# EAGLE design 4-layer-microstrip-nomask-osh (EAGLE 9.4.1)
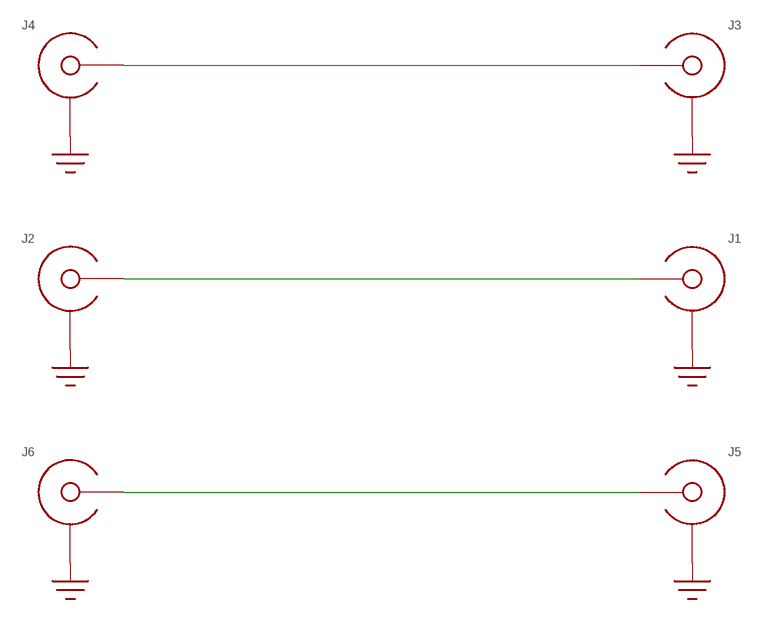
[diagram p0: schematic, sheet 1]

## Parts
J1  SMA-EDGE-LAUNCH4L-4020-TAPER-FIXED  [SMA_EDGE_LAUNCH_4L_4020_TAPER_FIXED]
J2  SMA-EDGE-LAUNCH4L-4020-TAPER-FIXED  [SMA_EDGE_LAUNCH_4L_4020_TAPER_FIXED]
J3  SMA-EDGE-LAUNCH4L-4020-TAPER-FIXED  [SMA_EDGE_LAUNCH_4L_4020_TAPER_FIXED]
J4  SMA-EDGE-LAUNCH4L-4020-TAPER-FIXED  [SMA_EDGE_LAUNCH_4L_4020_TAPER_FIXED]
J5  SMA-EDGE-LAUNCH4L-4020-TAPER-FIXED  [SMA_EDGE_LAUNCH_4L_4020_TAPER_FIXED]
J6  SMA-EDGE-LAUNCH4L-4020-TAPER-FIXED  [SMA_EDGE_LAUNCH_4L_4020_TAPER_FIXED]

## Nets
GND: J1.BOTTOM_GND(SHIELD) J1.GND@1(SHIELD) J1.GND@2(SHIELD) J1.GND@3(SHIELD) J1.GND@4(SHIELD) J1.GND@5(SHIELD) J1.GND@6(SHIELD) J1.GND@7(SHIELD) J1.GND@8(SHIELD) J1.GND@14(SHIELD) J1.GND@15(SHIELD) J1.GND@16(SHIELD) J1.GND@17(SHIELD) J1.GND_PAD1(SHIELD) J1.GND_PAD2(SHIELD) J1.P$1(SHIELD) J1.P$2(SHIELD) J2.BOTTOM_GND(SHIELD) J2.GND@1(SHIELD) J2.GND@2(SHIELD) J2.GND@3(SHIELD) J2.GND@4(SHIELD) J2.GND@5(SHIELD) J2.GND@6(SHIELD) J2.GND@7(SHIELD) J2.GND@8(SHIELD) J2.GND@14(SHIELD) J2.GND@15(SHIELD) J2.GND@16(SHIELD) J2.GND@17(SHIELD) J2.GND_PAD1(SHIELD) J2.GND_PAD2(SHIELD) J2.P$1(SHIELD) J2.P$2(SHIELD) J3.BOTTOM_GND(SHIELD) J3.GND@1(SHIELD) J3.GND@2(SHIELD) J3.GND@3(SHIELD) J3.GND@4(SHIELD) J3.GND@5(SHIELD) J3.GND@6(SHIELD) J3.GND@7(SHIELD) J3.GND@8(SHIELD) J3.GND@14(SHIELD) J3.GND@15(SHIELD) J3.GND@16(SHIELD) J3.GND@17(SHIELD) J3.GND_PAD1(SHIELD) J3.GND_PAD2(SHIELD) J3.P$1(SHIELD) J3.P$2(SHIELD) J4.BOTTOM_GND(SHIELD) J4.GND@1(SHIELD) J4.GND@2(SHIELD) J4.GND@3(SHIELD) J4.GND@4(SHIELD) J4.GND@5(SHIELD) J4.GND@6(SHIELD) J4.GND@7(SHIELD) J4.GND@8(SHIELD) J4.GND@14(SHIELD) J4.GND@15(SHIELD) J4.GND@16(SHIELD) J4.GND@17(SHIELD) J4.GND_PAD1(SHIELD) J4.GND_PAD2(SHIELD) J4.P$1(SHIELD) J4.P$2(SHIELD) J5.BOTTOM_GND(SHIELD) J5.GND@1(SHIELD) J5.GND@2(SHIELD) J5.GND@3(SHIELD) J5.GND@4(SHIELD) J5.GND@5(SHIELD) J5.GND@6(SHIELD) J5.GND@7(SHIELD) J5.GND@8(SHIELD) J5.GND@14(SHIELD) J5.GND@15(SHIELD) J5.GND@16(SHIELD) J5.GND@17(SHIELD) J5.GND_PAD1(SHIELD) J5.GND_PAD2(SHIELD) J5.P$1(SHIELD) J5.P$2(SHIELD) J6.BOTTOM_GND(SHIELD) J6.GND@1(SHIELD) J6.GND@2(SHIELD) J6.GND@3(SHIELD) J6.GND@4(SHIELD) J6.GND@5(SHIELD) J6.GND@6(SHIELD) J6.GND@7(SHIELD) J6.GND@8(SHIELD) J6.GND@14(SHIELD) J6.GND@15(SHIELD) J6.GND@16(SHIELD) J6.GND@17(SHIELD) J6.GND_PAD1(SHIELD) J6.GND_PAD2(SHIELD) J6.P$1(SHIELD) J6.P$2(SHIELD)
N$1 [50-ohm]: J1.CENTER@1(CENTER) J1.P$3(CENTER) J2.CENTER@1(CENTER) J2.P$3(CENTER)
N$2 [50-ohm]: J3.CENTER@1(CENTER) J3.P$3(CENTER) J4.CENTER@1(CENTER) J4.P$3(CENTER)
N$3 [50-ohm]: J5.CENTER@1(CENTER) J5.P$3(CENTER) J6.CENTER@1(CENTER) J6.P$3(CENTER)

## Library data of the parts
J1-J6 = yapo:SMA-EDGE-LAUNCH

## Net classes
1 50-ohm: clearance 2.54 mm

## Board
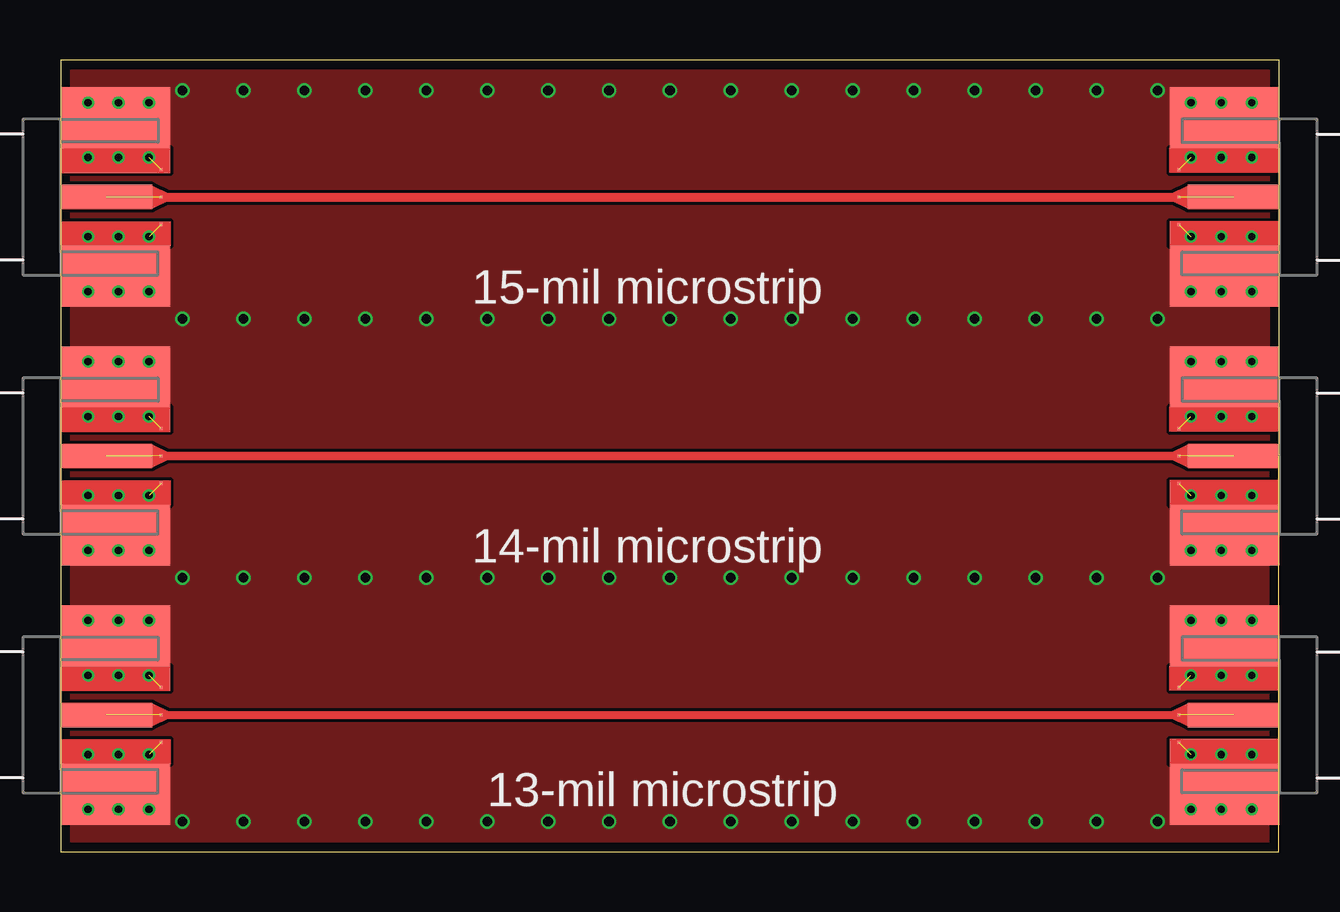
[diagram p1: board, top side]
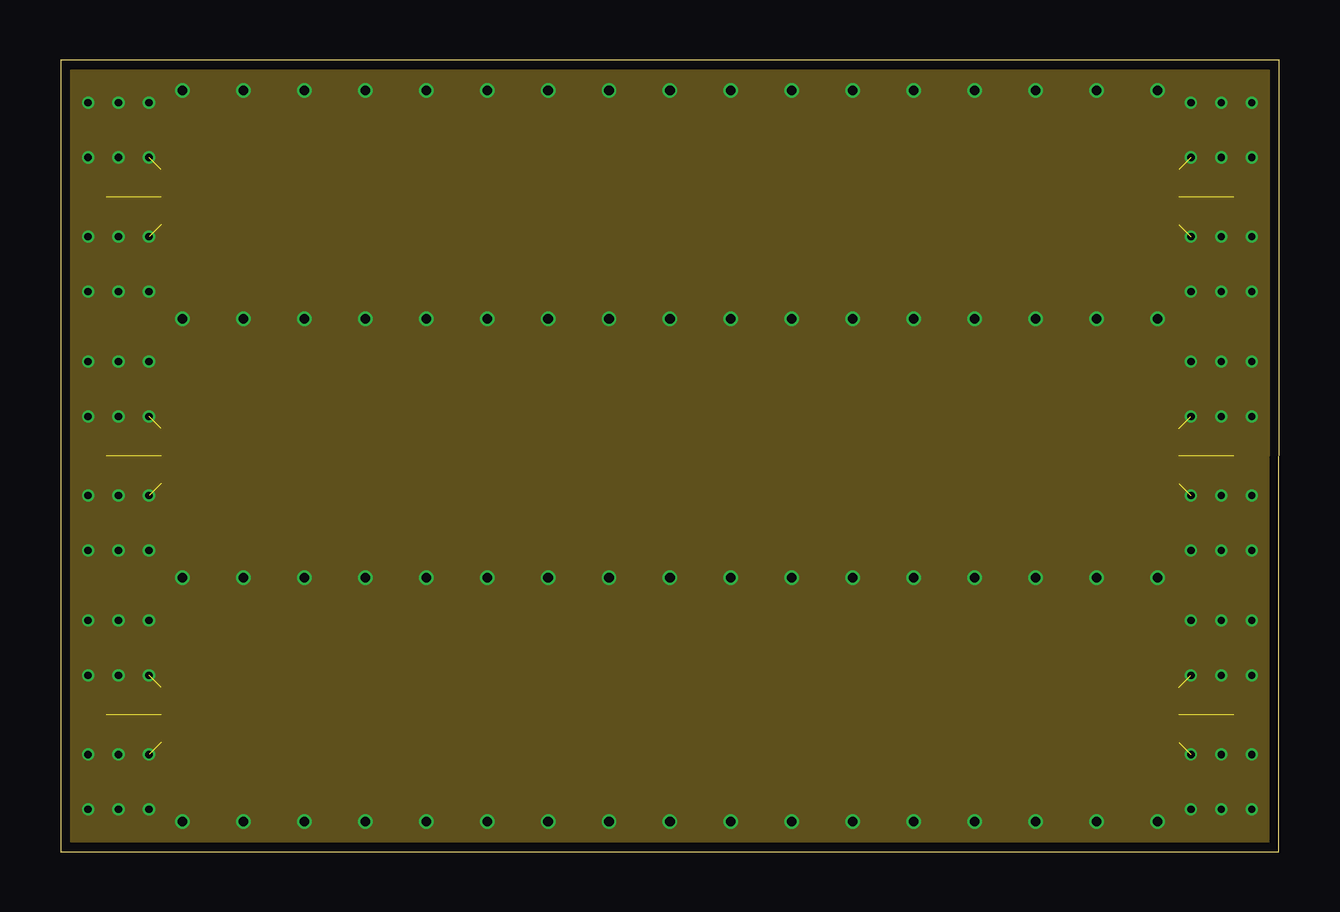
[diagram p2: board, inner layer Route2]
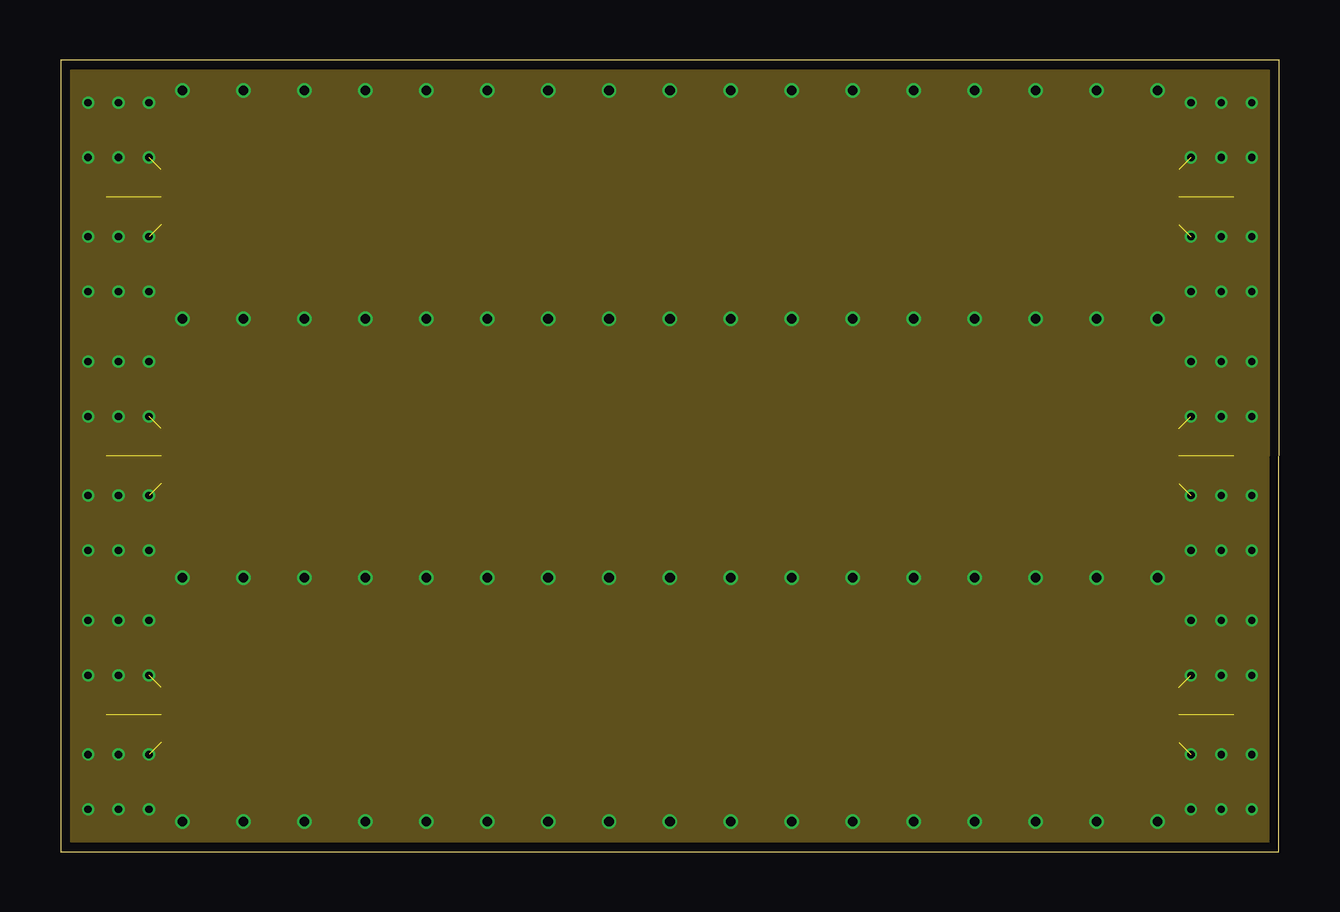
[diagram p3: board, inner layer Route15]
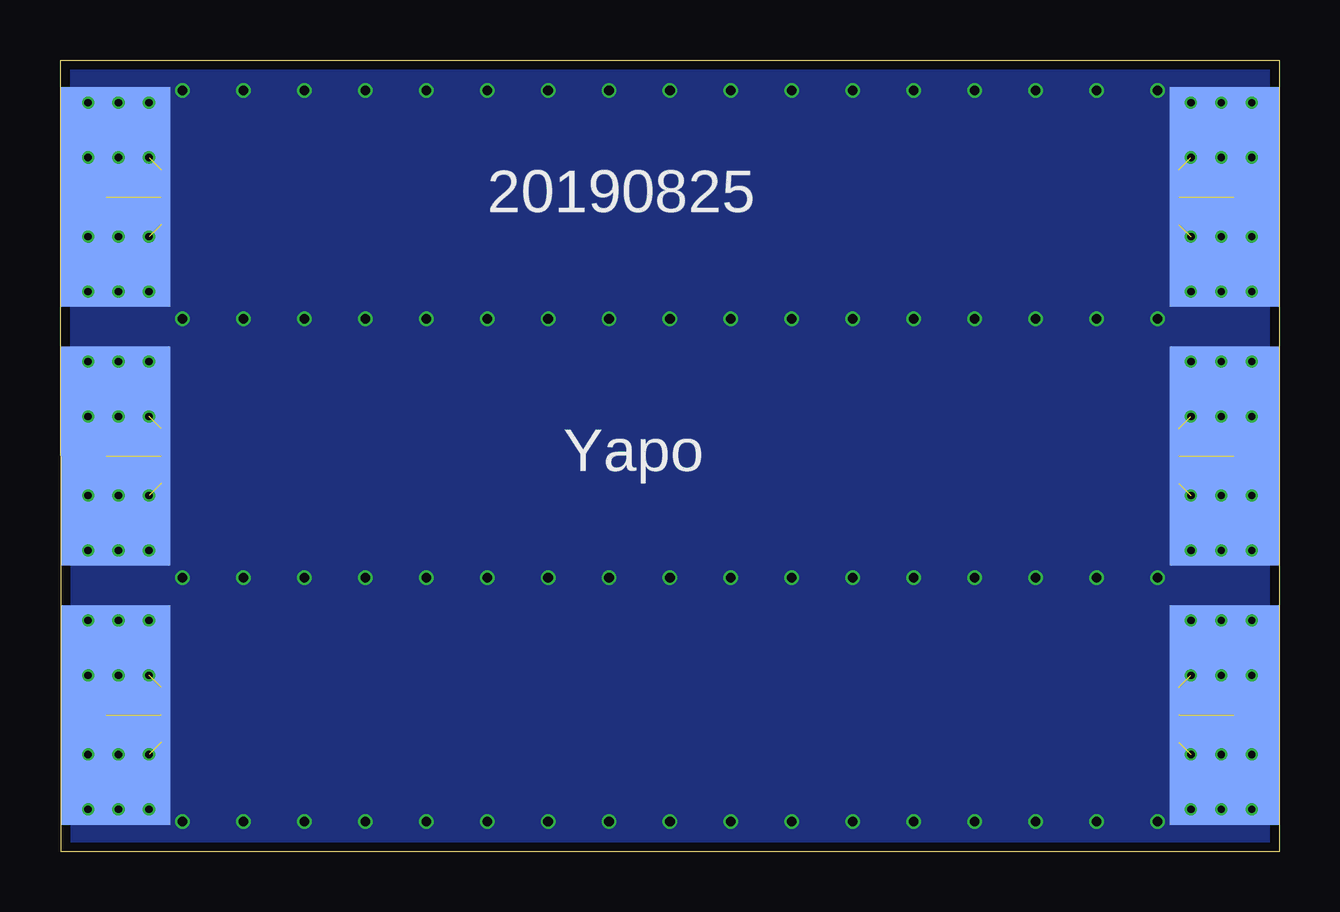
[diagram p4: board, bottom side, seen from below]

Size 50.8 x 33.02 mm. Coordinates in mm from the lower left corner, seen from the top.
Outline: 0,0 50.78,0 50.8,33.02 0,33.02 0,0
Copper layers (1*2*15*16): Top 0.035559375mm / dielectric 0.17018125mm / Route2 0.01778125mm / dielectric 47mil / Route15 0.01778125mm / dielectric 0.17018125mm / Bottom 0.035559375mm
Design rules "oshpark-4layer *": minimum track width 5mil, minimum drill 10mil, track to track 5mil, track to pad 5mil, pad to pad 5mil, via to via 5mil, smd to smd 5mil, copper to edge 15mil, drill to drill 6mil, minimum pad ring 4mil, minimum via ring 4mil, stop-mask expansion 2.5mil, vias tented up to drill 20mil, thermal gap 10mil

### Footprints (pad centres in the part's own frame; a part is rotated, then mirrored left to right if it is on the bottom)
SMA_EDGE_LAUNCH_4L_4020_TAPER_FIXED = smd 4.572 x 9.144 bottom: BOTTOM_GND 2.286,0 | smd 3.81 x 1.016: CENTER@1 1.905,0 | drill 0.3: GND@1 1.143,3.937; GND@2 3.683,3.937; GND@3 1.143,1.651; GND@4 3.683,1.651; GND@5 1.143,-1.651; GND@6 3.683,-1.651; GND@7 1.143,-3.937; GND@8 3.683,-3.937; GND@14 2.413,3.937; GND@15 2.413,-3.937; GND@16 2.413,-1.651; GND@17 2.413,1.651 | smd 4.572 x 2.54: GND_PAD1 2.286,3.302; GND_PAD2 2.286,-3.302 | smd 0.127 x 0.127: P$1 4.191,1.143; P$2 4.191,-1.143; P$3 4.191,0

### Placement (x,y rotation side)
J1  50.8,5.71 180 top
J2  0,5.71 0 top
J3  0,16.51 0 top
J4  50.8,16.51 180 top
J5  0,27.3 0 top
J6  50.8,27.3 180 top

### Tracks (layer width: path | path; a pad name or v marks a point on that pad's centre or on a via)
GND  (via drill 0.4)  (12 unrouted)
  other vias: 7.62,22.23 10.16,22.23 12.7,22.23 15.24,22.23 17.78,22.23 20.32,22.23 22.86,22.23 25.4,22.23 27.94,22.23 30.48,22.23 33.02,22.23 35.56,22.23 38.1,22.23 40.64,22.23 43.18,22.23 7.62,11.43 10.16,11.43 12.7,11.43 15.24,11.43 17.78,11.43 20.32,11.43 22.86,11.43 25.4,11.43 27.94,11.43 30.48,11.43 33.02,11.43 35.56,11.43 38.1,11.43 40.64,11.43 43.18,11.43 7.62,31.75 10.16,31.75 12.7,31.75 15.24,31.75 17.78,31.75 20.32,31.75 22.86,31.75 25.4,31.75 27.94,31.75 30.48,31.75 33.02,31.75 35.56,31.75 38.1,31.75 40.64,31.75 43.18,31.75 7.62,1.27 10.16,1.27 12.7,1.27 15.24,1.27 17.78,1.27 20.32,1.27 22.86,1.27 25.4,1.27 27.94,1.27 30.48,1.27 33.02,1.27 35.56,1.27 38.1,1.27 40.64,1.27 43.18,1.27 5.08,31.75 5.08,22.23 5.08,11.43 5.08,1.27 45.72,31.75 45.72,22.23 45.72,11.43 45.72,1.27
  pour Top (no thermals): 0,0 50.8,0 50.8,33.02 0,33.02
  pour Route2 (no thermals): 0,0 50.8,0 50.8,33.02 0,33.02
  pour Bottom (no thermals): 0,0 50.8,0 50.8,33.02 0,33.02
  pour Route15 (no thermals): 0,0 50.8,0 50.8,33.02 0,33.02
N$1  (2 unrouted)
  Top 0.33: J2.CENTER@1 J1.CENTER@1
N$2  (2 unrouted)
  Top 0.356: J3.CENTER@1 J4.CENTER@1
N$3  (2 unrouted)
  Top 0.381: J5.CENTER@1 J6.CENTER@1

### Text on the board
tPlace: 15-mil microstrip | 14-mil microstrip | 13-mil microstrip
bPlace: 20190825 | Yapo